# Altium schematic sheet Schematic-1.SchDoc
size 381 x 241 mm; SheetNumber: 1; SheetTotal: 1
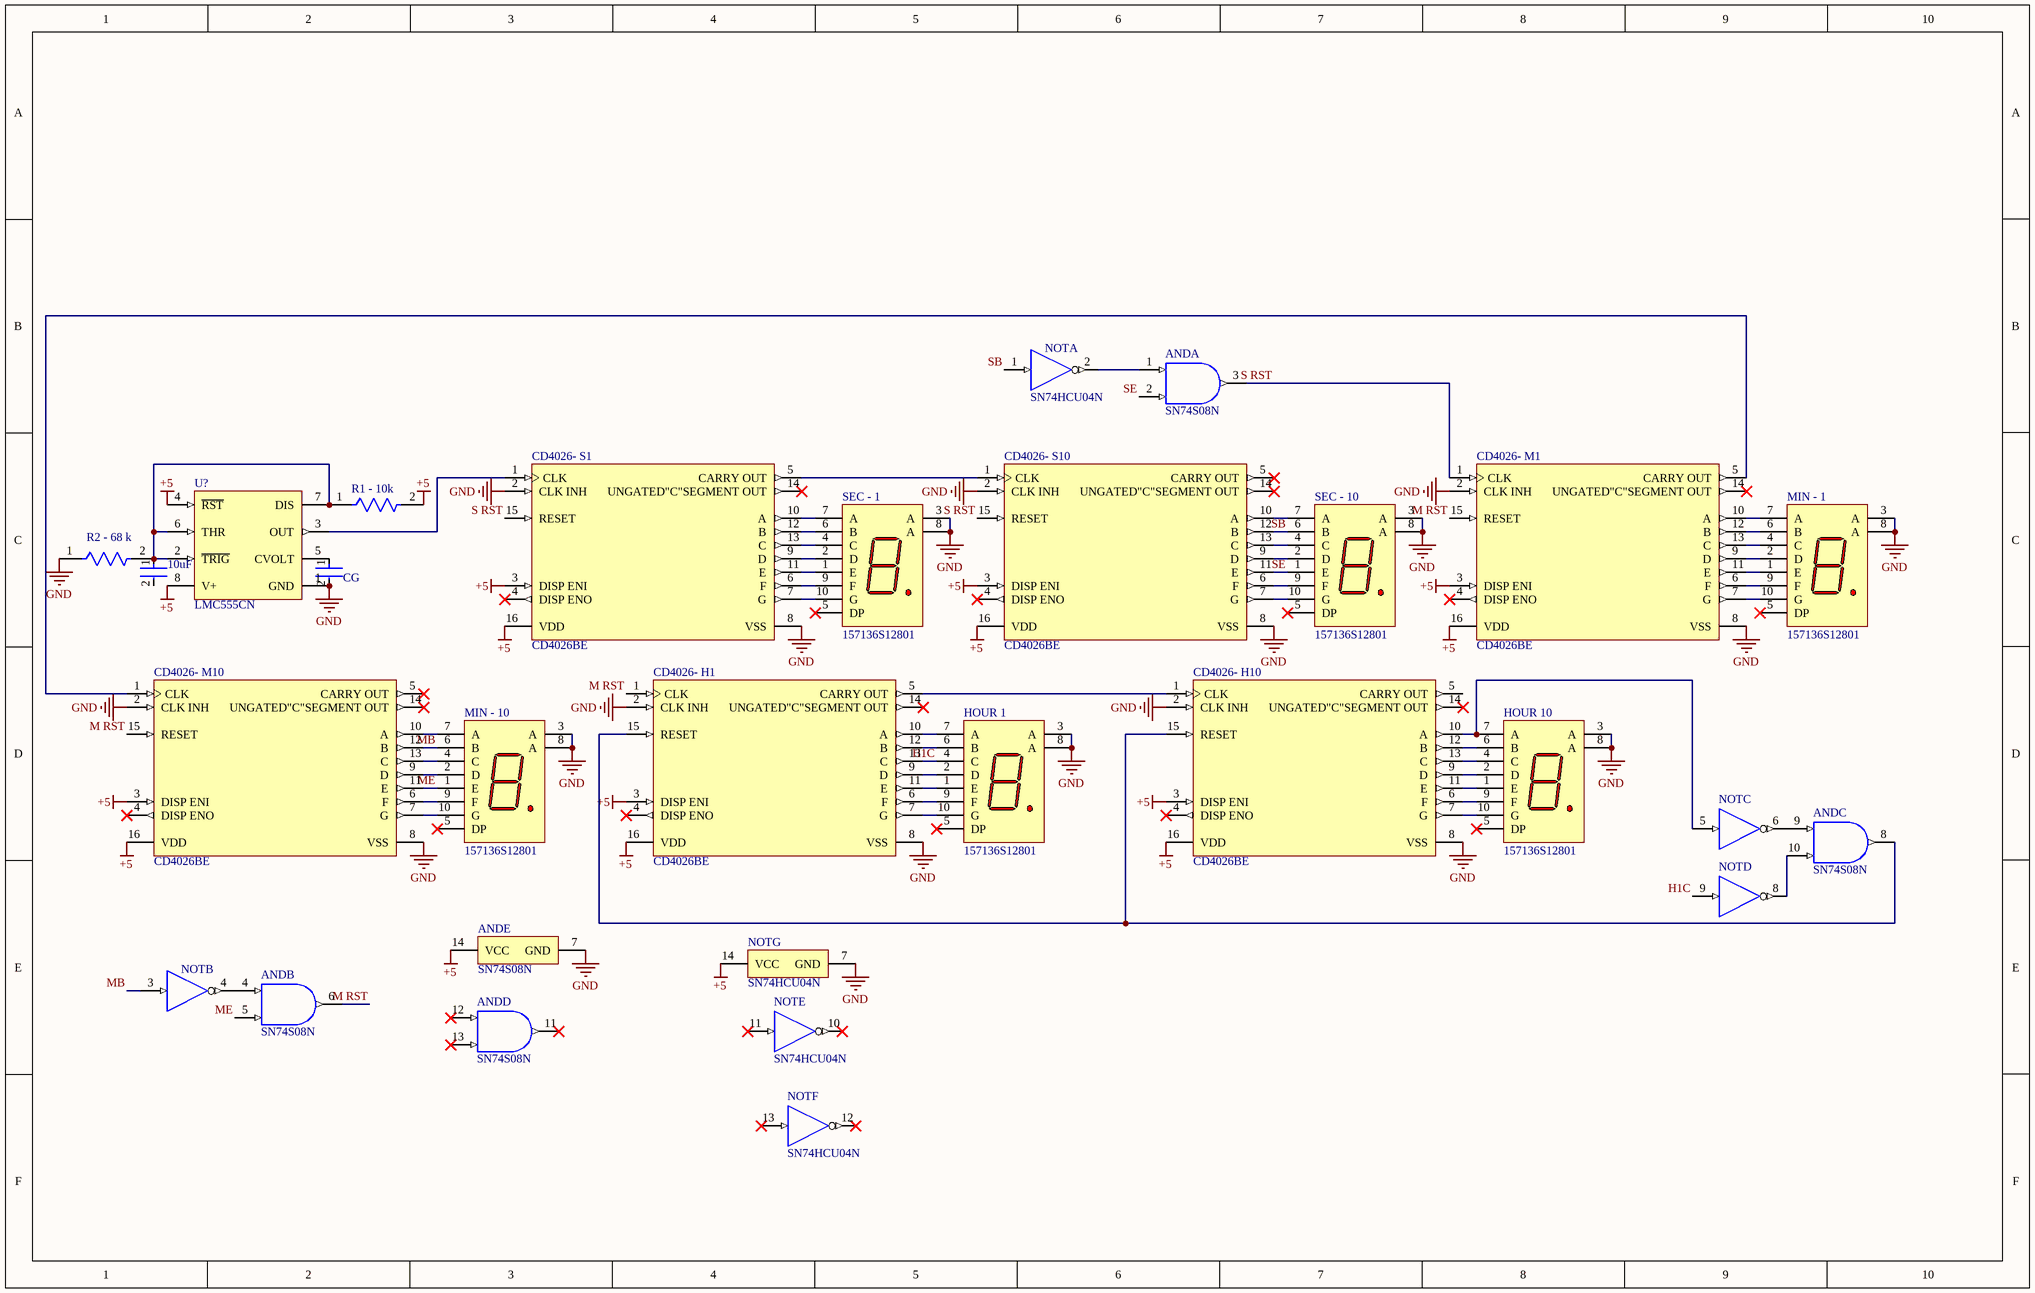
[diagram p0: Schematic-1.SchDoc]

## Parts
10uF  VY1472M63Y5UQ6TV0  [FP-VY1472M63Y5UQ6TV0-MFG]  (value not drawn)
AND  SN74S08N  [N0014A]  (parts A,B,C,D,E of 5)
CD4026-_H1  CD4026BE  [N0016A]
CD4026-_H10  CD4026BE  [N0016A]
CD4026-_M1  CD4026BE  [N0016A]
CD4026-_M10  CD4026BE  [N0016A]
CD4026-_S1  CD4026BE  [N0016A]
CD4026-_S10  CD4026BE  [N0016A]
CG  VY1472M63Y5UQ6TV0  [FP-VY1472M63Y5UQ6TV0-MFG]  (value not drawn)
HOUR_1  157136S12801  [WL-T7DS_L17.5W12.4H7]
HOUR_10  157136S12801  [WL-T7DS_L17.5W12.4H7]
MIN_-_1  157136S12801  [WL-T7DS_L17.5W12.4H7]
MIN_-_10  157136S12801  [WL-T7DS_L17.5W12.4H7]
NOT  SN74HCU04N  [N0014A]  (parts A,B,C,D,E,F,G of 7)
R1_-_10k  VR37000001204JA100  [FP-VR37-MFG]  (value not drawn)
R2_-_68_k  VR37000001204JA100  [FP-VR37-MFG]  (value not drawn)
SEC_-_1  157136S12801  [WL-T7DS_L17.5W12.4H7]
SEC_-_10  157136S12801  [WL-T7DS_L17.5W12.4H7]
U?  LMC555CN  [P0008A]

## Nets
+5: AND.14(VCC) CD4026-_H1.3(DISP_ENI) CD4026-_H1.16(VDD) CD4026-_H10.3(DISP_ENI) CD4026-_H10.16(VDD) CD4026-_M1.3(DISP_ENI) CD4026-_M1.16(VDD) CD4026-_M10.3(DISP_ENI) CD4026-_M10.16(VDD) CD4026-_S1.3(DISP_ENI) CD4026-_S1.16(VDD) CD4026-_S10.3(DISP_ENI) CD4026-_S10.16(VDD) NOT.14(VCC) R1_-_10k.2 U?.4(~{RST}) U?.8(V+)
GND: AND.7(GND) CD4026-_H1.2(CLK_INH) CD4026-_H1.8(VSS) CD4026-_H10.2(CLK_INH) CD4026-_H10.8(VSS) CD4026-_M1.2(CLK_INH) CD4026-_M1.8(VSS) CD4026-_M10.2(CLK_INH) CD4026-_M10.8(VSS) CD4026-_S1.2(CLK_INH) CD4026-_S1.8(VSS) CD4026-_S10.2(CLK_INH) CD4026-_S10.8(VSS) CG.2 HOUR_1.3(A) HOUR_1.8(A) HOUR_10.3(A) HOUR_10.8(A) MIN_-_1.3(A) MIN_-_1.8(A) MIN_-_10.3(A) MIN_-_10.8(A) NOT.7(GND) R2_-_68_k.1 SEC_-_1.3(A) SEC_-_1.8(A) SEC_-_10.3(A) SEC_-_10.8(A) U?.1(GND)
H1C: CD4026-_H1.13(C) HOUR_1.4(C) NOT.9(4A)
M RST: AND.6(2Y) CD4026-_H1.1(CLK) CD4026-_M1.15(RESET) CD4026-_M10.15(RESET)
MB: CD4026-_M10.12(B) MIN_-_10.6(B) NOT.3(2A)
ME: AND.5(2B) CD4026-_M10.11(E) MIN_-_10.1(E)
S RST: AND.3(1Y) CD4026-_M1.1(CLK) CD4026-_S1.15(RESET) CD4026-_S10.15(RESET)
SB: CD4026-_S10.12(B) NOT.1(1A) SEC_-_10.6(B)
SE: AND.2(1B) CD4026-_S10.11(E) SEC_-_10.1(E)
Net10uF_1: 10uF.1 R1_-_10k.1 R2_-_68_k.2 U?.2(~{TRIG}) U?.6(THR) U?.7(DIS)
NetAND_1: AND.1(1A) NOT.2(~{1Y})
NetAND_4: AND.4(2A) NOT.4(~{2Y})
NetAND_8: AND.8(3Y) CD4026-_H1.15(RESET) CD4026-_H10.15(RESET)
NetAND_9: AND.9(3A) NOT.6(~{3Y})
NetAND_10: AND.10(3B) NOT.8(~{4Y})
NetCD4026-_H1_5: CD4026-_H1.5(CARRY_OUT) CD4026-_H10.1(CLK)
NetCD4026-_H1_6: CD4026-_H1.6(F) HOUR_1.9(F)
NetCD4026-_H1_7: CD4026-_H1.7(G) HOUR_1.10(G)
NetCD4026-_H1_9: CD4026-_H1.9(D) HOUR_1.2(D)
NetCD4026-_H1_10: CD4026-_H1.10(A) HOUR_1.7(A)
NetCD4026-_H1_11: CD4026-_H1.11(E) HOUR_1.1(E)
NetCD4026-_H1_12: CD4026-_H1.12(B) HOUR_1.6(B)
NetCD4026-_H10_6: CD4026-_H10.6(F) HOUR_10.9(F)
NetCD4026-_H10_7: CD4026-_H10.7(G) HOUR_10.10(G)
NetCD4026-_H10_9: CD4026-_H10.9(D) HOUR_10.2(D)
NetCD4026-_H10_10: CD4026-_H10.10(A) HOUR_10.7(A) NOT.5(3A)
NetCD4026-_H10_11: CD4026-_H10.11(E) HOUR_10.1(E)
NetCD4026-_H10_12: CD4026-_H10.12(B) HOUR_10.6(B)
NetCD4026-_H10_13: CD4026-_H10.13(C) HOUR_10.4(C)
NetCD4026-_M1_5: CD4026-_M1.5(CARRY_OUT) CD4026-_M10.1(CLK)
NetCD4026-_M1_6: CD4026-_M1.6(F) MIN_-_1.9(F)
NetCD4026-_M1_7: CD4026-_M1.7(G) MIN_-_1.10(G)
NetCD4026-_M1_9: CD4026-_M1.9(D) MIN_-_1.2(D)
NetCD4026-_M1_10: CD4026-_M1.10(A) MIN_-_1.7(A)
NetCD4026-_M1_11: CD4026-_M1.11(E) MIN_-_1.1(E)
NetCD4026-_M1_12: CD4026-_M1.12(B) MIN_-_1.6(B)
NetCD4026-_M1_13: CD4026-_M1.13(C) MIN_-_1.4(C)
NetCD4026-_M10_6: CD4026-_M10.6(F) MIN_-_10.9(F)
NetCD4026-_M10_7: CD4026-_M10.7(G) MIN_-_10.10(G)
NetCD4026-_M10_9: CD4026-_M10.9(D) MIN_-_10.2(D)
NetCD4026-_M10_10: CD4026-_M10.10(A) MIN_-_10.7(A)
NetCD4026-_M10_13: CD4026-_M10.13(C) MIN_-_10.4(C)
NetCD4026-_S1_1: CD4026-_S1.1(CLK) U?.3(OUT)
NetCD4026-_S1_5: CD4026-_S1.5(CARRY_OUT) CD4026-_S10.1(CLK)
NetCD4026-_S1_6: CD4026-_S1.6(F) SEC_-_1.9(F)
NetCD4026-_S1_7: CD4026-_S1.7(G) SEC_-_1.10(G)
NetCD4026-_S1_9: CD4026-_S1.9(D) SEC_-_1.2(D)
NetCD4026-_S1_10: CD4026-_S1.10(A) SEC_-_1.7(A)
NetCD4026-_S1_11: CD4026-_S1.11(E) SEC_-_1.1(E)
NetCD4026-_S1_12: CD4026-_S1.12(B) SEC_-_1.6(B)
NetCD4026-_S1_13: CD4026-_S1.13(C) SEC_-_1.4(C)
NetCD4026-_S10_6: CD4026-_S10.6(F) SEC_-_10.9(F)
NetCD4026-_S10_7: CD4026-_S10.7(G) SEC_-_10.10(G)
NetCD4026-_S10_9: CD4026-_S10.9(D) SEC_-_10.2(D)
NetCD4026-_S10_10: CD4026-_S10.10(A) SEC_-_10.7(A)
NetCD4026-_S10_13: CD4026-_S10.13(C) SEC_-_10.4(C)
NetCG_1: CG.1 U?.5(CVOLT)

Not connected (* = marked no-connect by the designer): 10uF 2; AND 11(4Y)* 12(4A)* 13(4B)*; CD4026-_H1 4(DISP_ENO)* 14(UNGATED"C"SEGMENT_OUT)*; CD4026-_H10 4(DISP_ENO)* 5(CARRY_OUT) 14(UNGATED"C"SEGMENT_OUT)*; CD4026-_M1 4(DISP_ENO)* 14(UNGATED"C"SEGMENT_OUT)*; CD4026-_M10 4(DISP_ENO)* 5(CARRY_OUT)* 14(UNGATED"C"SEGMENT_OUT)*; CD4026-_S1 4(DISP_ENO)* 14(UNGATED"C"SEGMENT_OUT)*; CD4026-_S10 4(DISP_ENO)* 5(CARRY_OUT)* 14(UNGATED"C"SEGMENT_OUT)*; HOUR_1 5(DP)*; HOUR_10 5(DP)*; MIN_-_1 5(DP)*; MIN_-_10 5(DP)*; NOT 10(~{5Y})* 11(5A)* 12(~{6Y})* 13(6A)*; SEC_-_1 5(DP)*; SEC_-_10 5(DP)*

## Library data of the parts
10uF CG = CMP-02417-000050-1: CAP CER 4700PF 760VAC Y5U RADIAL; Voltage Rating (AC): 500V; Lead Diameter: 0.6mm; Capacitance: 4.7nF; Tolerance: 20%; Lead/Base Style: Kinked; Termination: Radial; Resistor Type: Ceramic; Radiation Hardening: No; Diameter: 16mm; Max Operating Temperature: 125°C; Case/Package: Radial; Thickness: 5mm; Lead Pitch: 10mm; Series: VY1; Contact Plating: Tin; Depth: 5mm; RoHS Compliant: Yes; Voltage: 500V; Voltage Rating (DC): 500V; Package Quantity: 500; Construction: RADIAL; Min Operating Temperature: -40°C; Height: 19mm; Height - Seated (Max): 0.787inch; Packaging: Tape and Reel; Dielectric: Y5U; Mount: Through Hole
AND = CMP-0777-00282-3: Quad 2-input positive-AND gates, N0014A, TUBE; Manufacturer: Texas Instruments; Output Drive (IOL/IOH)(Max)(mA): -24/24; Rating: Catalog; VCC(Min)(V): 4.75; Bits(#): 4; Input Type: TTL; Schmitt Trigger: No; tpd @ Nom Voltage(Max)(ns): 7.5; Technology Family: S; Voltage(Nom)(V): 5; VCC(Max)(V): 5.25; F @ Nom Voltage(Max)(Mhz): 50; ICC @ Nom Voltage(Max)(mA): 0.032; PackageReference: N0014A; DatasheetVersion: SDLS033; Operating Temperature Range(C): 0 to 70; Output Type: TTL; Generic Part Number: SN74S08
CD4026-_H1 CD4026-_H10 CD4026-_M1 CD4026-_M10 CD4026-_S1 CD4026-_S10 = CMP-1623-00561-2: CMOS Decade Counter/Divider with Decoded 7-Segment Display Outputs and Display Enable, N0016A, TUBE; Manufacturer: Texas Instruments; ICC @ Nom Voltage(Max)(mA): 0.03; tpd @ Nom Voltage(Max)(ns): 250; F @ Nom Voltage(Max)(Mhz): 8; Bits(#): 7; VCC(Max)(V): 18; VCC(Min)(V): 3; Output Drive (IOL/IOH)(Max)(mA): 1.5/-1.5; Inputs: 1; Rating: Catalog; Technology Family: CD4000; Schmitt Trigger: No; Voltage(Nom)(V): 5,10,15; DatasheetVersion: SCHS031B; Operating Temperature Range(C): -55 to 125; Code_JEDEC: MS-001; Input Type: CMOS; Output Type: CMOS; Type: Decade; Generic Part Number: CD4026B; PackageReference: N0016A; Function: Counter
HOUR_1 HOUR_10 MIN_-_1 MIN_-_10 SEC_-_1 SEC_-_10 = CMP-03913-119893999-3: 7-Seg Display, Comm Anode, Super Red Rohs Compliant: Yes; Forward Voltage: 2V; Dominant Wavelength: 635nm; Max Reverse Voltage (DC): 5V; Forward Current: 100mA; Luminous Intensity: 20mcd; Width: 12.4mm; Max Operating Temperature: 85°C; Min Operating Temperature: -40°C; Height: 7mm; RoHS: Compliant; Length: 17.5mm
NOT = CMP-1615-00910-2: Hex Inverters, N0014A, TUBE; Manufacturer: Texas Instruments; Technology Family: HC; Bits(#): 6; Schmitt Trigger: No; Output Drive (IOL/IOH)(Max)(mA): -4/4; Input Type: CMOS; F @ Nom Voltage(Max)(Mhz): 20; VCC(Min)(V): 2; Voltage(Nom)(V): 5; ICC @ Nom Voltage(Max)(mA): 0.02; Rating: Catalog; Operating Temperature Range(C): -40 to 85; Generic Part Number: SN74HCU04; VCC(Max)(V): 6; PackageReference: N0014A; tpd @ Nom Voltage(Max)(ns): 20; Output Type: CMOS; Code_JEDEC: MS-001; DatasheetVersion: SCLS079E
R1_-_10k R2_-_68_k = CMP-02408-000054-1: RES 1.2M OHM 5% 1/2W AXIAL; Voltage Rating: 3.5kV; Power Rating: 500mW; Temperature Coefficient: 200ppm/°C; Resistance: 1.2MR; Diameter: 4mm; Max Operating Temperature: 155°C; Military Standard: Not; Reach SVHC Compliant: Yes; Min Operating Temperature: -55°C; Resistance Tolerance: 5%; Resistor Type: Metal Film; Tolerance: 5%; Mount: Through Hole; Construction: Cylindrical; Contact Plating: Tin; Length: 10mm; Termination: Axial; Voltage Rating (DC): 3.5kV; Packaging: Ammo Pack; Radiation Hardening: No; Case/Package: Conformal
U? = CMP-0056-00035-3: CMOS Timer, 8-pin MDIP; Manufacturer: Texas Instruments; PowerWise: N; CompType: Analog IC; PackageTopMarking: NSUZXYTTE#*LMC*555CN; PackageReference: P0008A; ComponentLink1Description: Datasheet URL; PinCount: 8; ComponentLink1URL: http://www.ti.com/general/docs/lit/getliterature.tsp?genericPartNumber=LMC555&fileType=pdf; PackageDescription: MDIP, .365 x .250 x .130in, 8 Lead, .100in Pitch; RoHS: N; Code_JEDEC: MS-001-BA